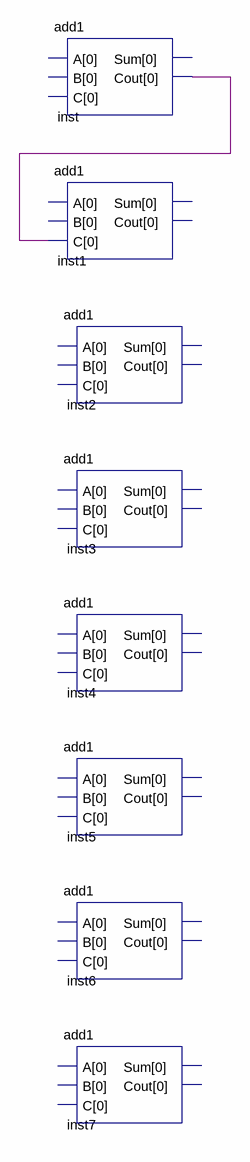
[diagram p0: schematic sheet]
// Quartus schematic pre-add8.bdf as structural Verilog: 8 symbols, 0 pins
module \pre-add8  (
);

  wire inst_cout;

  add1 inst (.Cout(inst_cout));  // open: A, B, C, Sum
  add1 inst1 (.C(inst_cout));  // open: A, B, Sum, Cout
  add1 inst2 ();  // open: A, B, C, Sum, Cout
  add1 inst3 ();  // open: A, B, C, Sum, Cout
  add1 inst4 ();  // open: A, B, C, Sum, Cout
  add1 inst5 ();  // open: A, B, C, Sum, Cout
  add1 inst6 ();  // open: A, B, C, Sum, Cout
  add1 inst7 ();  // open: A, B, C, Sum, Cout
endmodule
